# Altium project door.PrjPcb
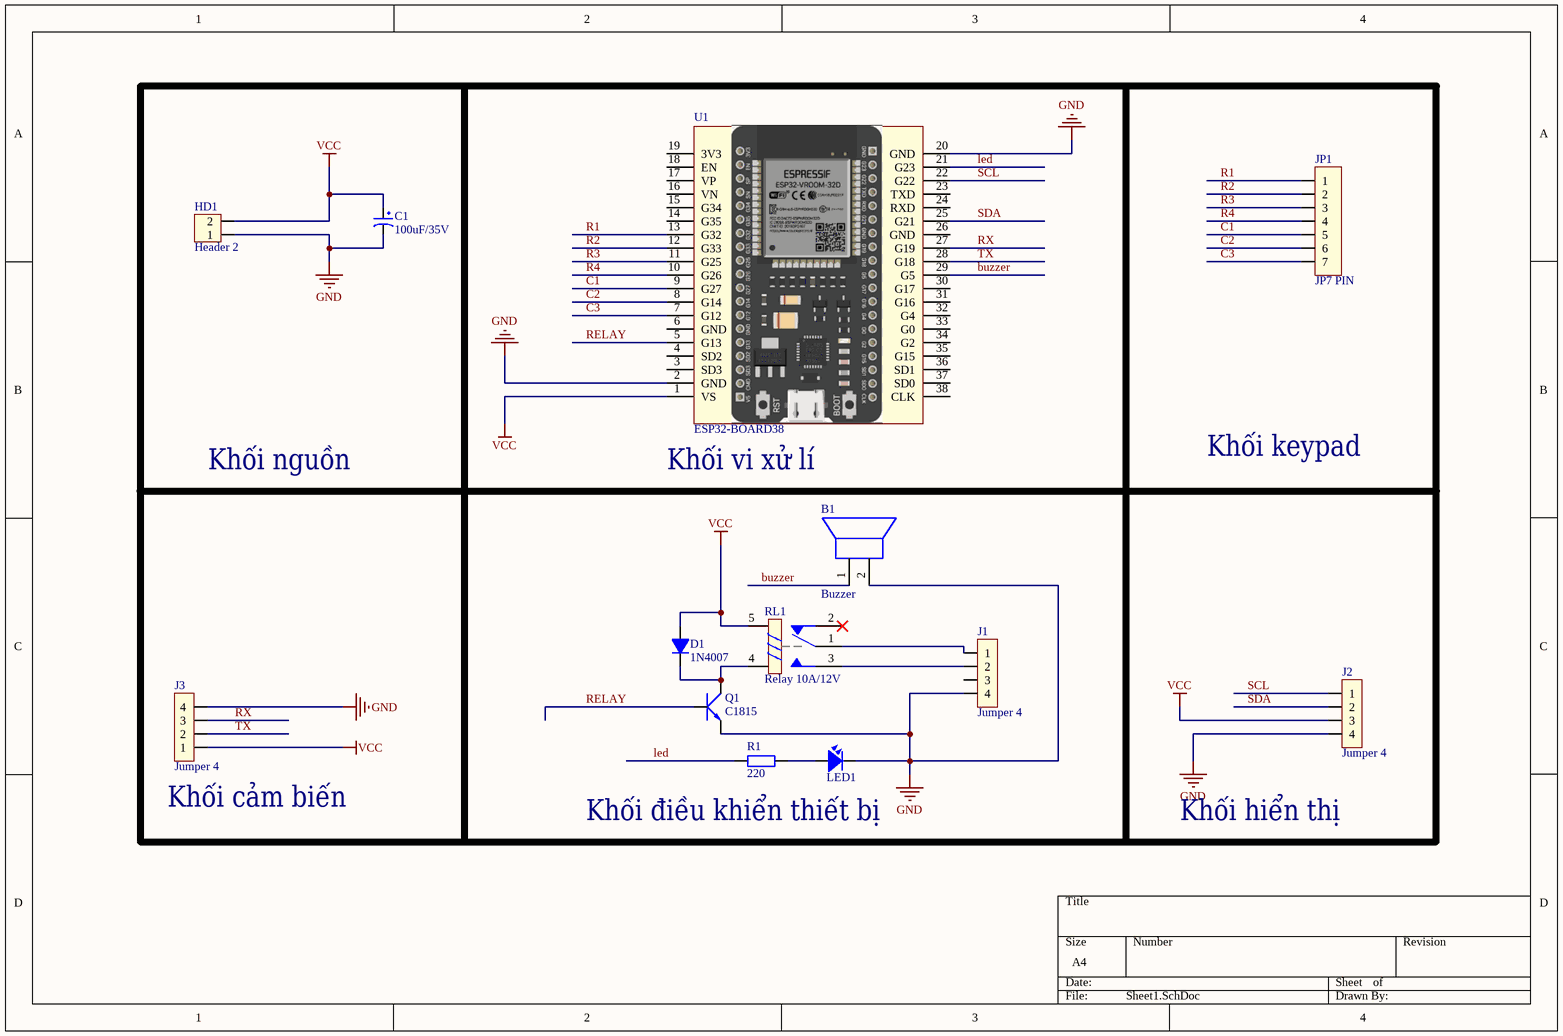
[diagram p0: Sheet1.SchDoc]
1 sheet, 13 parts. Net scope: global (net labels, ports and power ports of the same name join across sheets).
Board file: PCB1.PcbDoc

## Sheet Sheet1.SchDoc
size A4; SheetNumber: 1; SheetTotal: 1

### Parts
B1  Buzzer  [Buzzer]
C1  100uF/35V  [CP1.5/3.4]
D1  1N4007  [D1A]
HD1  Header 2  [HED2]
J1  Jumper 4  [JP4]
J2  Jumper 4  [JP4]
J3  Jumper 4  [JP4]
JP1  JP7 PIN  [JP7]
LED1  LED  [LED-3]  (value not drawn)
Q1  C1815  [QTO-92]
R1  220  [R1/4W]
RL1  Relay 10A/12V  [RL_SPDT_10A]
U1  ESP32-BOARD38  [ESP32-BOARD38-900]

### Nets
GND: B1.2(-) C1.2 HD1.1 J1.4 J2.4 J3.4 LED1.2 Q1.1(E) U1.2(GND) U1.20(GND)
VCC: C1.1 D1.1(A) HD1.2 J2.3 J3.1 RL1.5 U1.1(VS)
buzzer: B1.1(+) U1.29(G5)
C1: JP1.5 U1.9(G27)
C2: JP1.6 U1.8(G14)
C3: JP1.7 U1.7(G12)
led: R1.1 U1.21(G23)
R1: JP1.1 U1.13(G32)
R2: JP1.2 U1.12(G33)
R3: JP1.3 U1.11(G25)
R4: JP1.4 U1.10(G26)
RELAY: Q1.3(B) U1.5(G13)
RX: J3.3 U1.27(G19)
SCL: J2.1 U1.22(G22)
SDA: J2.2 U1.25(G21)
TX: J3.2 U1.28(G18)
NetD1_2: D1.2(K) Q1.2(C) RL1.4
NetJ1_1: J1.1 RL1.1
NetJ1_2: J1.2 RL1.3
NetLED1_1: LED1.1 R1.2

Not connected (* = marked no-connect by the designer): J1 3; RL1 2*; U1 3(SD3) 4(SD2) 6(GND) 14(G35) 15(G34) 16(VN) 17(VP) 18(EN) 19(3V3) 23(TXD) 24(RXD) 26(GND) 30(G17) 31(G16) 32(G4) 33(G0) 34(G2) 35(G15) 36(SD1) 37(SD0) 38(CLK)

### Notes on the sheet
- Khối nguồn
- (near U1) Khối vi xử lí
- Khối keypad
- (near J3) Khối cảm biến
- Khối điều khiển thiết bị
- Khối hiển thị

### Library data of the parts
C1 = CP3: Cap 100uF/35V - 470uF/16V; Value: 100uF/35V/50V; Description 1: 1000uF/6,3V - 470uF/16V - 330uF - 25V; Description 2: 220uF/35V - 100uF/50V - 63V - 4,7uF/200V; Description 3: 22uF => 33uF100V - 3,3uF => 4,7uF/250V; Description 4: 2,2uF =>3,3uF/350 - 2,2uF/400V - 1uF/450V
D1 = D1A: Diode 1A; Value: 1N4007
HD1 = Hed2: Header 2 (Green); Value: Header 2
J1-J3 = JP4: Value: J3
JP1 = JP7: Value: JP7
LED1 = LED: LED Single colour Green and Red; Value: LED 3 ly Single Colour
Q1 = C1815: NPN 600mW, ECB; Value: C1815
R1 = R1/4W: Resistor 1/4W; Value: R1/4W - 1K
RL1 = Relay 1: Relay SPDT,10A - 12VDC 5 Pin; Value: Relay SPDT, 10A, 12V